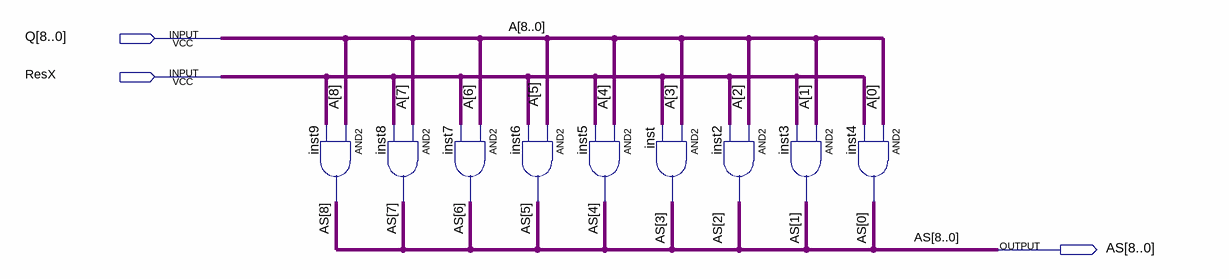
[diagram p0: schematic sheet]
// Quartus schematic andWithRes.bdf as structural Verilog: 9 symbols, 3 pins
module andWithRes (
  input  [8:0] Q,
  input  ResX,
  output [8:0] AS
);

  and inst9 (AS[8], Q[8], ResX);
  and inst8 (AS[7], Q[7], ResX);
  and inst7 (AS[6], Q[6], ResX);
  and inst5 (AS[4], Q[4], ResX);
  and inst6 (AS[5], Q[5], ResX);
  and inst (AS[3], Q[3], ResX);
  and inst2 (AS[2], Q[2], ResX);
  and inst3 (AS[1], Q[1], ResX);
  and inst4 (AS[0], Q[0], ResX);

  // Other names for the same wires on the sheet: A[8:0] = Q
endmodule
